# Altium project CRIUS FT232RL 6-pin basic breakout board.PrjPcb
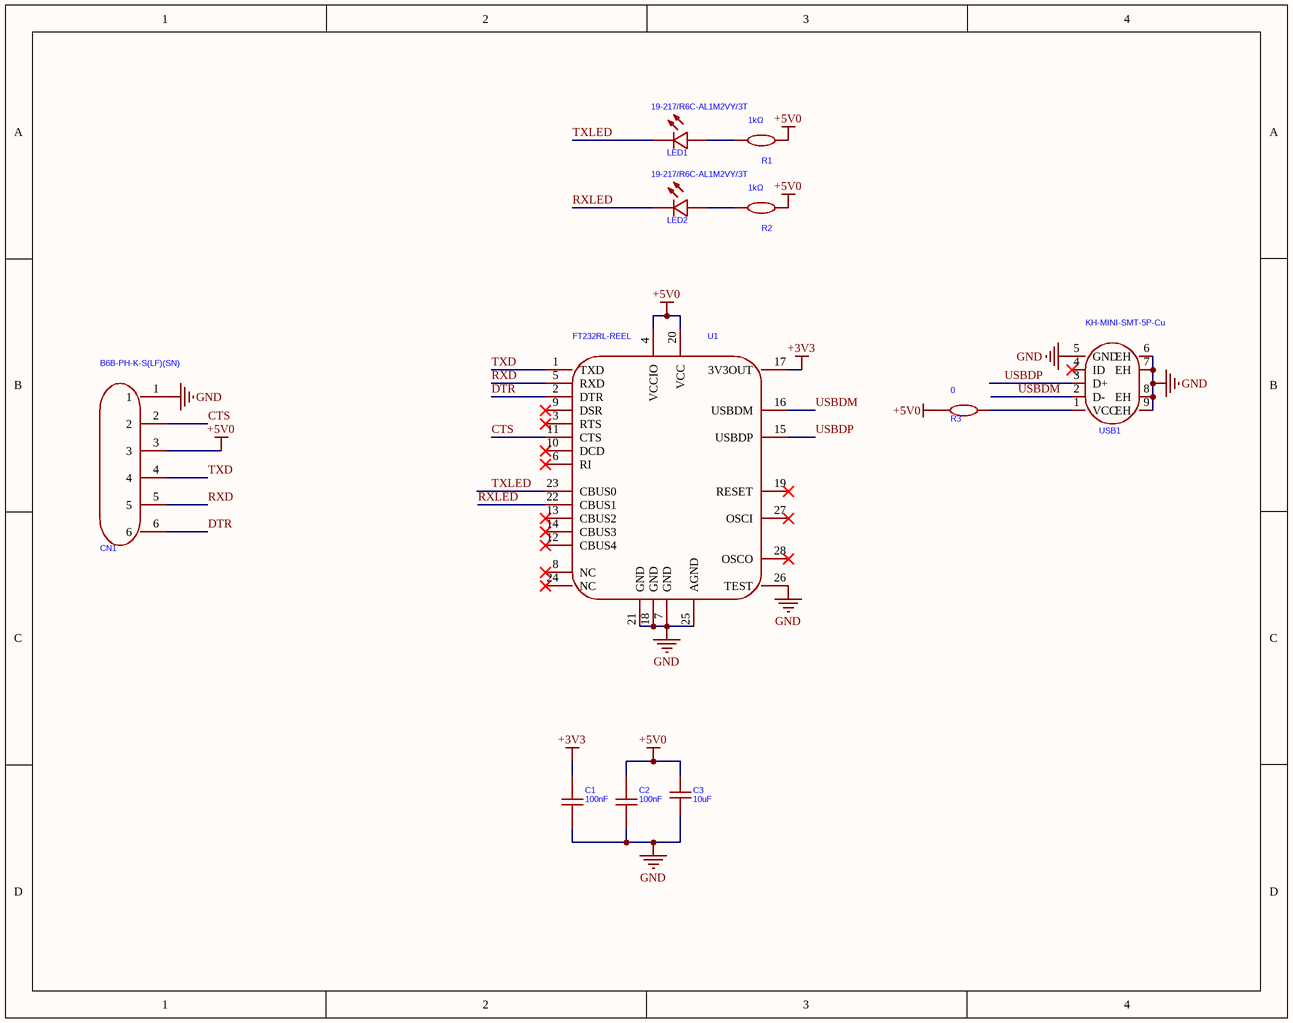
[diagram p0: Sheet1.SchDoc]
1 sheet, 11 parts. Net scope: global (net labels, ports and power ports of the same name join across sheets).
Board file: PCB1.PcbDoc

## Sheet Sheet1.SchDoc
size A; SheetNumber: 1; SheetTotal: 1

### Parts
C1  100nF  [C0603]
C2  100nF  [C0603]
C3  10uF  [C1206]
CN1  B6B-PH-K-S(LF)(SN)  [CONN-TH_B6B-PH-K-S]
LED1  19-217/R6C-AL1M2VY/3T  [LED0603-RD]
LED2  19-217/R6C-AL1M2VY/3T  [LED0603-RD]
R1  1kΩ  [R0603]
R2  1kΩ  [R0603]
R3  0  [R0603]
U1  FT232RL-REEL  [SSOP-28_L10.2-W5.3-P0.65-LS7.8-BL]
USB1  KH-MINI-SMT-5P-Cu  [MINI-USB-SMD_KH-MINI-SMT-5P-CU]

### Nets
+3V3: C1.2 U1.17(3V3OUT)
+5V0: C2.2 C3.2 CN1.3 R1.2 R2.2 R3.1 U1.4(VCCIO) U1.20(VCC)
GND: C1.1 C2.1 C3.1 CN1.1 U1.7(GND) U1.18(GND) U1.21(GND) U1.25(AGND) U1.26(TEST) USB1.5(GND) USB1.6(EH) USB1.7(EH) USB1.8(EH) USB1.9(EH)
CTS: CN1.2 U1.11(CTS)
DTR: CN1.6 U1.2(DTR)
RXD: CN1.5 U1.5(RXD)
RXLED: LED2.1(C) U1.22(CBUS1)
TXD: CN1.4 U1.1(TXD)
TXLED: LED1.1(C) U1.23(CBUS0)
USBDM: U1.16(USBDM) USB1.2(D-)
USBDP: U1.15(USBDP) USB1.3(D+)
NetLED1_2: LED1.2(A) R1.1
NetLED2_2: LED2.2(A) R2.1
NetR3_2: R3.2 USB1.1(VCC)

Not connected (* = marked no-connect by the designer): U1 3(RTS)* 6(RI)* 8(NC)* 9(DSR)* 10(DCD)* 12(CBUS4)* 13(CBUS2)* 14(CBUS3)* 19(RESET)* 24(NC)* 27(OSCI)* 28(OSCO)*; USB1 4(ID)*

### Library data of the parts
C1 C2 = CC0603KRX7R9BB104: Manufacturer: YAGEO(国巨); Add into BOM: yes; Tolerance: ±10%; Symbol: CC0603KRX7R9BB104; Device: CC0603KRX7R9BB104; LCSC Part Name: 100nF ±10% 50V; Supplier Part: C14663; Manufacturer Part: CC0603KRX7R9BB104; Supplier Footprint: 0603; JLCPCB Part Class: Basic Part; Datasheet: https://atta.szlcsc.com/upload/public/pdf/source/20180910/C282072_33301C7F631E79921B82A8DAC6BCC5B3.pdf; Supplier: LCSC; Convert to PCB: yes; Value: 100nF
C3 = CL31A106KBHNNNE: Manufacturer: SAMSUNG(三星); Add into BOM: yes; Tolerance: ±10%; Symbol: CL31A106KBHNNNE; Device: CL31A106KBHNNNE; LCSC Part Name: 10uF ±10% 50V; Supplier Part: C13585; Manufacturer Part: CL31A106KBHNNNE; Supplier Footprint: 1206; JLCPCB Part Class: Basic Part; Datasheet: https://atta.szlcsc.com/upload/public/pdf/source/20160218/1457707763339.pdf; Supplier: LCSC; Convert to PCB: yes; Value: 10uF
CN1 = B6B-PH-K-S(LF)(SN)_C131342: Manufacturer: JST; Add into BOM: yes; Pins Structure: 1x6P; Pitch: 2mm; Reference Series: PH; Number of PINs Per Row: 6; Current Rating (Max): 2A; Rated Voltage (Max): 100V; Plastic Material: PA66; Flame Retardant Rating: UL94V-0; Supplementary Features: 打K脚; Z-Height of the Board: 6mm; X-Length of Bottom Edge on Board (Spacing Line): 13.9mm; Y-Width of Bottom Edge on Board: 4.5mm; Symbol: B6B-PH-K-S(LF)(SN); Device: B6B-PH-K-S(LF)(SN)_C131342; LCSC Part Name: 1x6P 间距:2mm 直插 系列:PH; Supplier Part: C131342; Manufacturer Part: B6B-PH-K-S(LF)(SN); Supplier Footprint: 插件,P=2mm; JLCPCB Part Class: Extended Part; Datasheet: https://atta.szlcsc.com/upload/public/pdf/source/20171026/C131342_15089839687311058815.pdf; Supplier: LCSC; Convert to PCB: yes; Mounting Style: Straight; Number of Pins: 6P; Number of Rows: 1; Row Spacing: -; Contact Material: Brass; Contact Plating: Tin; Operating Temperature Range: -25℃~+85℃; Colour: White
LED1 LED2 = 19-217/R6C-AL1M2VY/3T: Manufacturer: EVERLIGHT(亿光); Add into BOM: yes; Emitted Color: Red; Forward Voltage (VF): 1.95V; Power Dissipation: 60mW; Forward Current: 5mA; Dominant Wavelength: 617.5nm; Peak Wavelength: 632nm; Lens Color: Colorless Transparent Lens; Viewing Angle: 120°; Symbol: 19-217/R6C-AL1M2VY/3T; Device: 19-217/R6C-AL1M2VY/3T; LCSC Part Name: 红灯 停产 停产; Supplier Part: C72044; Manufacturer Part: 19-217/R6C-AL1M2VY/3T; Supplier Footprint: 0603; JLCPCB Part Class: Extended Part; Datasheet: https://atta.szlcsc.com/upload/public/pdf/source/20160507/1462613613821.pdf; Supplier: LCSC; Convert to PCB: yes; Diode Configuration: -; Color Temperature: -; Mounting Sytle: -; Operating Temperature: -40℃~+85℃
R1 R2 = RC0603FR-071KL: Manufacturer: YAGEO(国巨); Add into BOM: yes; Tolerance: ±1%; Power(Watts): 100mW; Voltage-Supply(Max): 75V; Temperature Coefficient: ±100ppm/℃; Symbol: RC0603FR-071KL; Device: RC0603FR-071KL; LCSC Part Name: 厚膜电阻 1kΩ ±1% 100mW; Supplier Part: C22548; Manufacturer Part: RC0603FR-071KL; Supplier Footprint: 0603; JLCPCB Part Class: Extended Part; Datasheet: https://atta.szlcsc.com/upload/public/pdf/source/20180316/70C0E2BDAE7FCC62C531A5A58D202EE1.pdf; Supplier: LCSC; Convert to PCB: yes; Type: Thick Film Resistors; Value: 1kΩ; Operating Temperature: -55℃~+155℃
R3 = RC0603FR-071KL: Manufacturer: YAGEO(国巨); Add into BOM: yes; Value: 1kΩ; Tolerance: ±1%; Power(Watts): 100mW; Voltage-Supply(Max): 75V; Temperature Coefficient: ±100ppm/℃; Symbol: RC0603FR-071KL; Device: RC0603FR-071KL; LCSC Part Name: 厚膜电阻 1kΩ ±1% 100mW; Supplier Part: C22548; Manufacturer Part: RC0603FR-071KL; Supplier Footprint: 0603; JLCPCB Part Class: Extended Part; Datasheet: https://atta.szlcsc.com/upload/public/pdf/source/20180316/70C0E2BDAE7FCC62C531A5A58D202EE1.pdf; Supplier: LCSC; Convert to PCB: yes; Type: Thick Film Resistors; Operating Temperature: -55℃~+155℃
U1 = FT232RL-REEL: Manufacturer: FTDI(飞特帝亚); Add into BOM: yes; Applications Function: USB to UART; Supply Voltage: 3.3V~5.25V; Symbol: FT232RL-REEL; Device: FT232RL-REEL; LCSC Part Name: FT232R USB UART 芯片; Supplier Part: C8690; Manufacturer Part: FT232RL-REEL; Supplier Footprint: SSOP-28-208mil; JLCPCB Part Class: Extended Part; Datasheet: https://atta.szlcsc.com/upload/public/pdf/source/20130221/1457706592200.pdf; Supplier: LCSC; Convert to PCB: yes; Operating Temperature: -40℃~+85℃
USB1 = KH-MINI-SMT-5P-Cu: Manufacturer: kinghelm(金航标); Add into BOM: yes; Connector Type: Mini-B; Gender: Female; Number of Ports: 1; Number of Contacts: 5P; Current Rating - Power (Max): 1A; Symbol: KH-MINI-SMT-5P-CU; Device: KH-MINI-SMT-5P-Cu; LCSC Part Name: Mini-B 母 卧贴; Supplier Part: C2688795; Manufacturer Part: KH-MINI-SMT-5P-Cu; Supplier Footprint: SMD; JLCPCB Part Class: Extended Part; Datasheet: https://atta.szlcsc.com/upload/public/pdf/source/20210202/C2688795_BF0BB16DAD2ABFC9845DEEA6AC1A1F9C.pdf; Supplier: LCSC; Convert to PCB: yes; Standard: USB 2.0; Mounting Style: 卧贴; Contact Material: -; Contact Plating: -; Operating Temperature Range: -; Soldering Temperature(Max): -